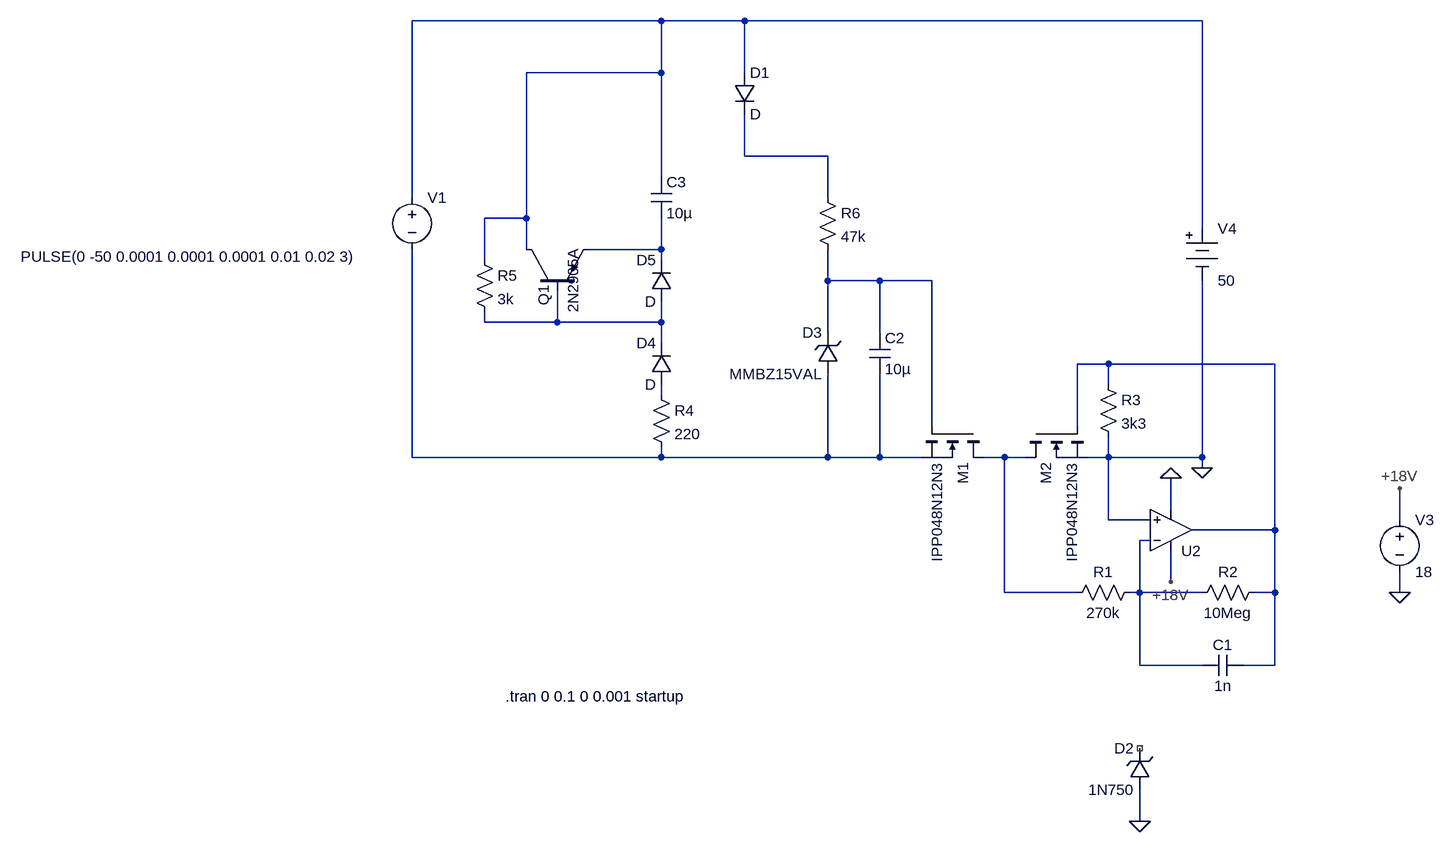
[diagram p0: schematic CAP_HW1_Detect_PNP.asc]
CAP_HW1_Detect_PNP.asc, the LTspice schematic file:
Version 4
SHEET 1 984 1140
WIRE -208 -128 -592 -128
WIRE -80 -128 -208 -128
WIRE 624 -128 -80 -128
WIRE -208 -48 -208 -128
WIRE -208 -48 -416 -48
WIRE -80 -48 -80 -128
WIRE -80 80 -80 16
WIRE 48 80 -80 80
WIRE -208 112 -208 -48
WIRE -592 144 -592 -128
WIRE 48 144 48 80
WIRE -416 176 -416 -48
WIRE -416 176 -480 176
WIRE 624 192 624 -128
WIRE -416 224 -416 176
WIRE -208 224 -208 176
WIRE -208 224 -320 224
WIRE -480 240 -480 176
WIRE -208 240 -208 224
WIRE 48 272 48 224
WIRE 128 272 48 272
WIRE 208 272 128 272
WIRE -480 336 -480 320
WIRE -368 336 -368 288
WIRE -368 336 -480 336
WIRE -208 336 -208 304
WIRE -208 336 -368 336
WIRE 48 352 48 272
WIRE 128 352 128 272
WIRE -208 368 -208 336
WIRE 480 400 432 400
WIRE 736 400 480 400
WIRE 480 432 480 400
WIRE -208 448 -208 432
WIRE 208 496 208 272
WIRE 432 496 432 400
WIRE -592 544 -592 224
WIRE -208 544 -208 528
WIRE -208 544 -592 544
WIRE 48 544 48 416
WIRE 48 544 -208 544
WIRE 128 544 128 416
WIRE 128 544 48 544
WIRE 192 544 128 544
WIRE 320 544 288 544
WIRE 352 544 320 544
WIRE 480 544 480 512
WIRE 480 544 448 544
WIRE 624 544 624 272
WIRE 624 544 480 544
WIRE 624 560 624 544
WIRE 576 624 576 576
WIRE 480 640 480 544
WIRE 544 640 480 640
WIRE 928 640 928 592
WIRE 736 656 736 400
WIRE 736 656 608 656
WIRE 544 672 528 672
WIRE 576 736 576 688
WIRE 320 752 320 544
WIRE 432 752 320 752
WIRE 528 752 528 672
WIRE 528 752 512 752
WIRE 624 752 528 752
WIRE 736 752 736 656
WIRE 736 752 704 752
WIRE 928 752 928 720
WIRE 528 864 528 752
WIRE 624 864 528 864
WIRE 736 864 736 752
WIRE 736 864 688 864
WIRE 528 1104 528 1056
FLAG 928 752 0
FLAG 928 592 +18V
FLAG 624 560 0
FLAG 576 736 +18V
FLAG 576 576 0
FLAG 528 1104 0
SYMBOL nmos 288 496 R90
SYMATTR InstName M1
SYMATTR Value IPP048N12N3
SYMBOL nmos 352 496 M90
SYMATTR InstName M2
SYMATTR Value IPP048N12N3
SYMBOL voltage 928 624 R0
WINDOW 123 0 0 Left 0
WINDOW 39 0 0 Left 0
SYMATTR InstName V3
SYMATTR Value 18
SYMBOL res 528 736 R90
WINDOW 0 0 56 VBottom 2
WINDOW 3 32 56 VTop 2
SYMATTR InstName R1
SYMATTR Value 270k
SYMBOL res 720 736 R90
WINDOW 0 0 56 VBottom 2
WINDOW 3 32 56 VTop 2
SYMATTR InstName R2
SYMATTR Value 10Meg
SYMBOL res 464 416 R0
SYMATTR InstName R3
SYMATTR Value 3k3
SYMBOL cap 688 848 R90
WINDOW 0 0 32 VBottom 2
WINDOW 3 32 32 VTop 2
SYMATTR InstName C1
SYMATTR Value 1n
SYMATTR SpiceLine V=50
SYMBOL res -224 432 R0
SYMATTR InstName R4
SYMATTR Value 220
SYMBOL diode -96 -48 R0
SYMATTR InstName D1
SYMBOL res 32 128 R0
SYMATTR InstName R6
SYMATTR Value 47k
SYMBOL zener 64 416 R180
WINDOW 0 24 64 Left 2
WINDOW 3 24 0 Left 2
SYMATTR InstName D3
SYMATTR Value MMBZ15VAL
SYMBOL cap 112 352 R0
SYMATTR InstName C2
SYMATTR Value 10µ
SYMBOL Misc\\battery 624 176 R0
WINDOW 123 0 0 Left 0
WINDOW 39 0 0 Left 0
SYMATTR InstName V4
SYMATTR Value 50
SYMBOL OpAmps\\UniversalOpamp2 576 656 M180
SYMATTR InstName U2
SYMBOL voltage -592 128 R0
WINDOW 3 -602 107 Left 2
WINDOW 123 0 0 Left 0
WINDOW 39 0 0 Left 0
SYMATTR Value PULSE(0 -50 0.0001 0.0001 0.0001 0.01 0.02 3)
SYMATTR InstName V1
SYMBOL zener 544 1056 R180
WINDOW 0 24 64 Left 2
WINDOW 3 24 0 Left 2
SYMATTR InstName D2
SYMATTR Value 1N750
SYMBOL cap -224 112 R0
SYMATTR InstName C3
SYMATTR Value 10µ
SYMBOL pnp -416 288 R270
WINDOW 0 -23 27 Left 2
WINDOW 3 -34 72 Left 2
SYMATTR InstName Q1
SYMATTR Value 2N2905A
SYMBOL diode -192 304 R180
WINDOW 0 24 64 Left 2
WINDOW 3 24 0 Left 2
SYMATTR InstName D5
SYMBOL res -496 224 R0
SYMATTR InstName R5
SYMATTR Value 3k
SYMBOL diode -192 432 R180
WINDOW 0 24 64 Left 2
WINDOW 3 24 0 Left 2
SYMATTR InstName D4
TEXT -448 912 Left 2 !.tran 0 0.1 0 0.001 startup

The netlist it stands for:
* CAP_HW1_Detect_PNP.asc
M1 N009 N004 N008 N008 IPP048N12N3
M2 N009 N006 0 0 IPP048N12N3
V3 +18V 0 18
R1 N010 N009 270k
R2 N006 N010 10Meg
R3 N006 0 3k3
C1 N006 N010 1n V=50
R4 N007 N008 220
D1 N001 N002 D
R6 N002 N004 47k
D3 N008 N004 MMBZ15VAL
C2 N004 N008 10µ
V4 N001 0 50
XU2 0 N010 +18V 0 N006 level.2 Avol=1Meg GBW=10Meg Slew=10Meg ilimit=25m rail=0 Vos=0 phimargin=45 en=0 enk=0 in=0 ink=0 Rin=500Meg  ; pins IN+ IN- V+ V- OUT
V1 N001 N008 PULSE(0 -50 0.0001 0.0001 0.0001 0.01 0.02 3)
D2 0 NC_01 1N750
C3 N001 N003 10µ
Q1 N001 N005 N003 0 2N2905A
D5 N005 N003 D
R5 N001 N005 3k
D4 N007 N005 D
.model D D
.lib standard.dio
.model NPN NPN
.model PNP PNP
.lib standard.bjt
.model NMOS NMOS
.model PMOS PMOS
.lib standard.mos
.tran 0 0.1 0 0.001 startup
.lib UniversalOpamps2.sub
.backanno
.end